# EAGLE design Sensor_Module_0x09_0x10_Pulse_v1 (EAGLE 9.1.1)
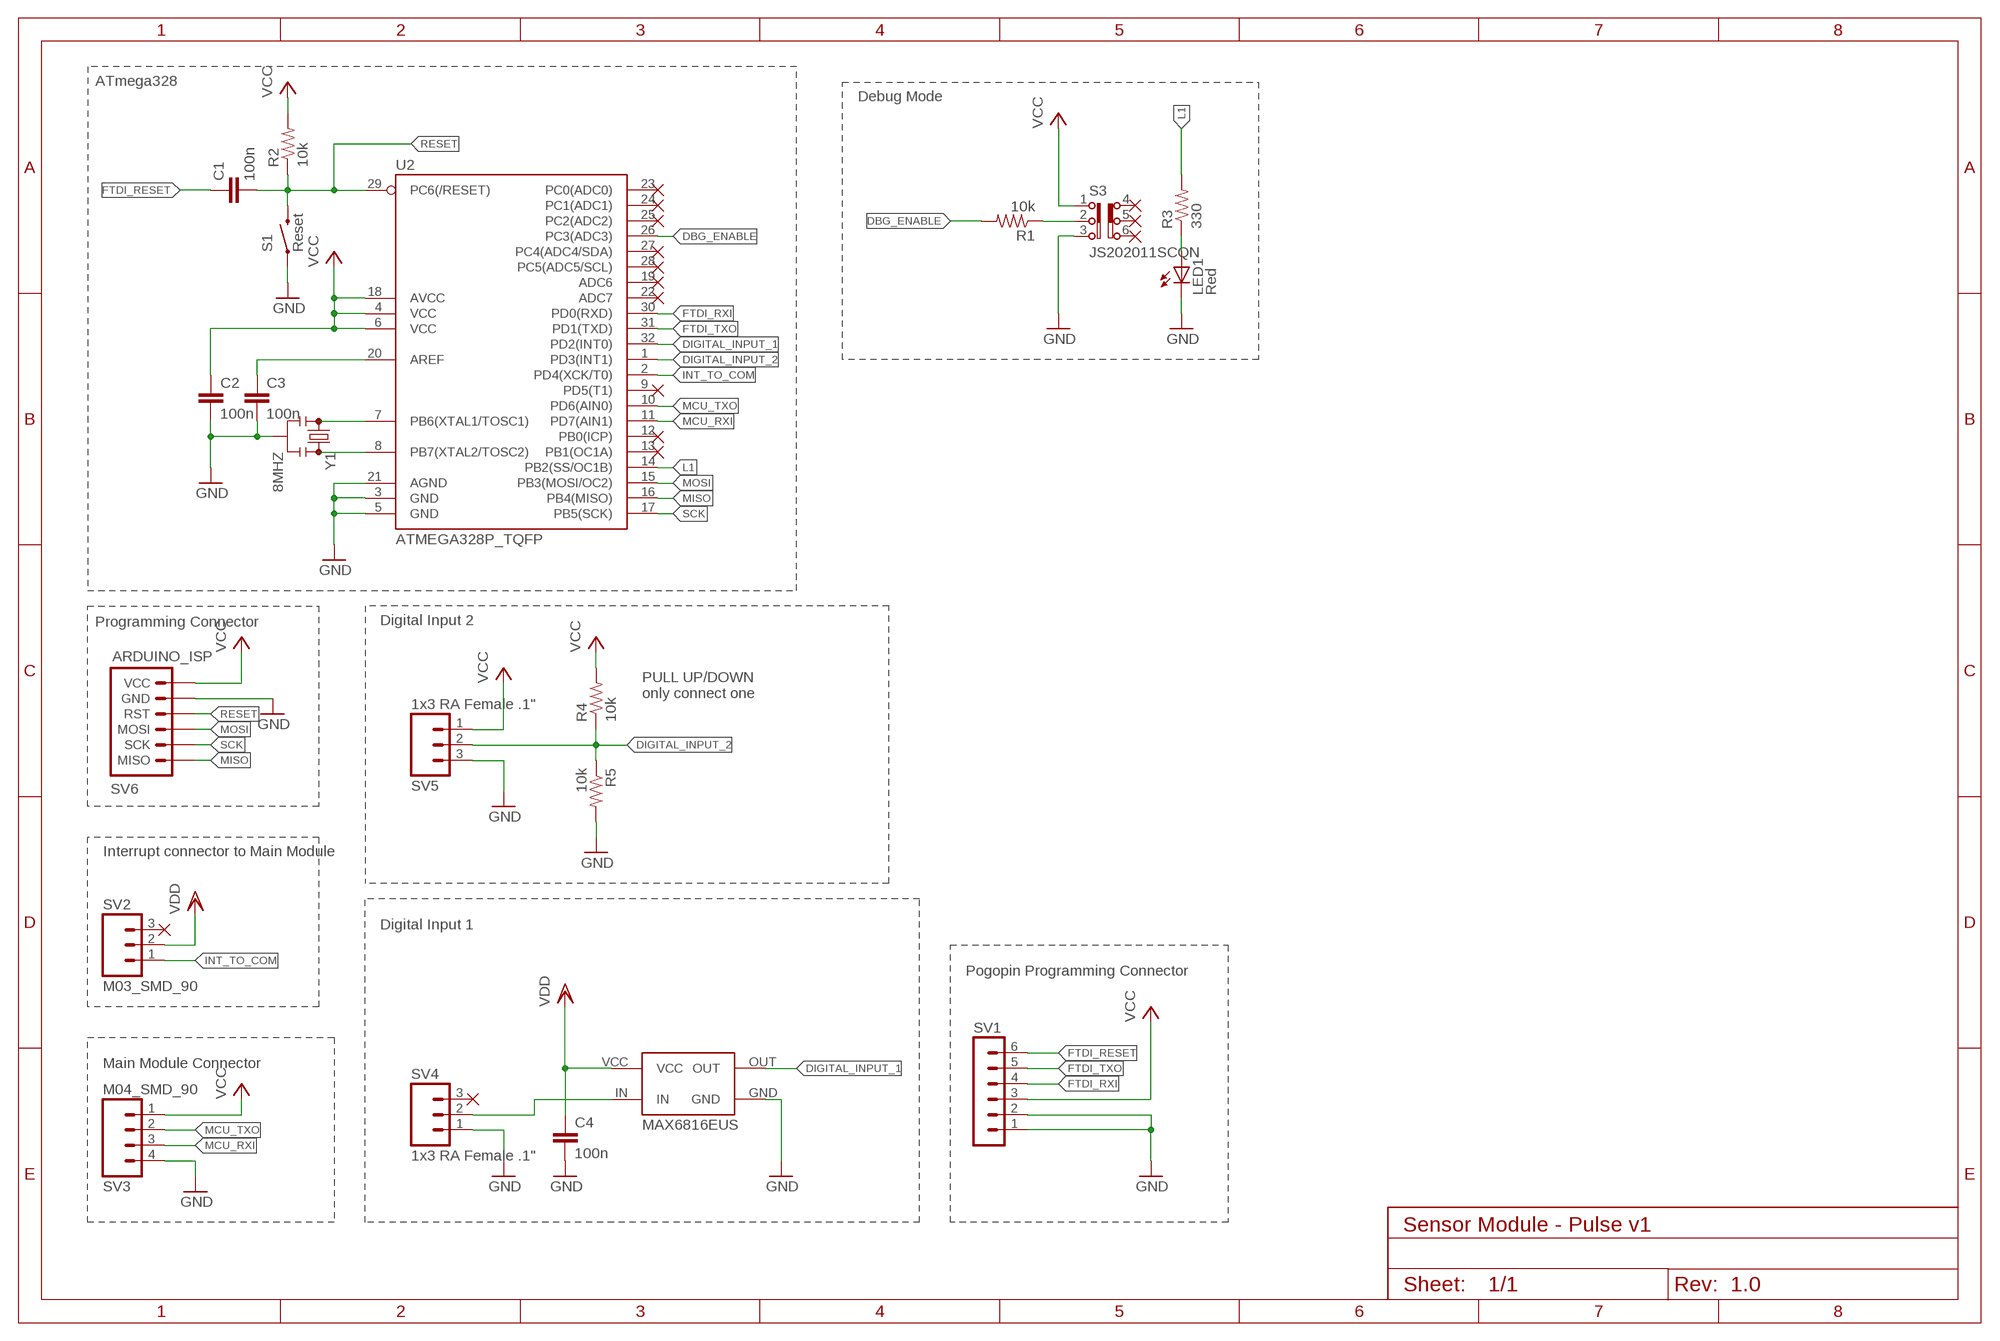
[diagram p0: schematic, sheet 1]
FRAME1 (FRAME-A4L): CNAME: Communication Module; CREVISION: 2.0

## Parts
C1  100n  C  [C0805]
C2  100n  C  [C0805]
C3  100n  C  [C0805]
C4  100n  C  [C0805]
LED1  Red  LEDSML0805  [SML0805]
R1  10k  RESISTOR0805-RES  [0805]
R2  10k  RESISTOR0805-RES  [0805]
R3  330  RESISTOR0805-RES  [0805]
R4  10k  RESISTOR0805-RES  [0805]
R5  10k  RESISTOR0805-RES  [0805]
S1  Reset  PUSHBUTTON  [M-PUSHBUTTON-SMD]
S3  JS202011SCQN  [JS202011SCQN]
SV1  MA06-1  [MA06-1]
SV2  M03_SMD_90  [M03_SMD_90]
SV3  M04_SMD_90  [M04_SMD_90]
SV4  1x3 RA Female .1"  M03SMD_RA_FEMALE  [1X03_SMD_RA_FEMALE]
SV5  1x3 RA Female .1"  M03SMD_RA_FEMALE  [1X03_SMD_RA_FEMALE]
SV6  ARDUINO_ISP  [M-2X3]
U2  ATMEGA328P_TQFP  [TQFP32-08]
U$2  MAX6816EUS  [SOT143]
Y1  8MHZ  RESONATOR8MHZ  [RESONATOR-SMD]

## Nets
DBG_ENABLE: R1.2 U2.26(PC3(ADC3))
DIGITAL_INPUT_1: U2.32(PD2(INT0)) U$2.OUT
DIGITAL_INPUT_2: R4.1 R5.1 SV5.2 U2.1(PD3(INT1))
FTDI_RESET: C1.1 SV1.6
FTDI_RXI: SV1.4 U2.30(PD0(RXD))
FTDI_TXO: SV1.5 U2.31(PD1(TXD))
GND [GND]: C2.2 C3.2 C4.2 LED1.C R5.2 S1.1(LEFT) S1.2(LEFT) S3.3 SV1.1 SV1.2 SV3.4 SV4.1 SV5.3 SV6.P$5(GND) U2.3(GND) U2.5(GND) U2.21(AGND) U$2.GND Y1.2
INT_TO_COM: SV2.1 U2.2(PD4(XCK/T0))
L1: R3.2 U2.14(PB2(SS/OC1B))
MCU_RXI: SV3.3 U2.11(PD7(AIN1))
MCU_TXO: SV3.2 U2.10(PD6(AIN0))
MISO: SV6.P$1(MISO) U2.16(PB4(MISO))
MOSI: SV6.P$3(MOSI) U2.15(PB3(MOSI/OC2))
N$1: U2.8(PB7(XTAL2/TOSC2)) Y1.3
N$2: U2.7(PB6(XTAL1/TOSC1)) Y1.1
N$3: R1.1 S3.2
N$4: SV4.2 U$2.IN
N$15: C3.1 U2.20(AREF)
N$30: LED1.A R3.1
RESET: C1.2 R2.1 S1.3(RIGHT) S1.4(RIGHT) SV6.P$4(RST) U2.29(PC6(/RESET))
SCK: SV6.P$2(SCK) U2.17(PB5(SCK))
VCC [Vsupply]: C2.1 R2.2 R4.2 S3.1 SV1.3 SV3.1 SV5.1 SV6.P$6(VCC) U2.4(VCC) U2.6(VCC) U2.18(AVCC)
VDD [Vsupply]: C4.1 SV2.2 U$2.VCC
Unconnected: S3.4 S3.5 S3.6 SV2.3 SV4.3 U2.9(PD5(T1)) U2.12(PB0(ICP)) U2.13(PB1(OC1A)) U2.19(ADC6) U2.22(ADC7) U2.23(PC0(ADC0)) U2.24(PC1(ADC1)) U2.25(PC2(ADC2)) U2.27(PC4(ADC4/SDA)) U2.28(PC5(ADC5/SCL))

## Notes on the sheet
- ATmega328
- Debug Mode
- Programming Connector | Digital Input 2
- PULL UP/DOWN
  only connect one
- Interrupt connector to Main Module
- Digital Input 1
- Pogopin Programming Connector
- Main Module Connector
- Sensor Module - Pulse v1
- 1.0

## Library data of the parts
C1-C4 = eagle-ltspice:C: CAPACITOR, European symbol; SPICEMODEL: NONE; SPICEPREFIX: C
LED1 = led:LED: LED OSRAM: - CHIPLED LG R971, LG N971, LY N971, LG Q971, LY Q971, LO R971, LY R971 LH N974, LH R974 LS Q976, LO Q976, LY Q976 LO Q996 - Hyper CHIPLED LW Q18S LB Q993, LB Q99A, LB R99A - SideLED LS A670, LO A670, LY A670, LG A670, LP A670 LB A673, LV A673, LT A673, LW A673 LH A674 LY A675 LS A676, LA A676, LO A676, LY A676, LW A676 LS A679, LY A679, LG A679 - Hyper Micro SIDELED® LS Y876, LA Y876, LO Y876, LY Y876 LT Y87S - SmartLED LW L88C, LW L88S LB L89C, LB L89S, LG L890 LS L89K, LO L89K, LY L89K LS L896, LA L896, LO L896, LY L896 - TOPLED LS T670, LO T670, LY T670, LG T670, LP T670 LSG T670, LSP T670, LSY T670, LOP T670, LYG T670 LG T671, LOG T671, LSG T671 LB T673, LV T673, LT T673, LW T673 LH T674 LS T676, LA T676, LO T676, LY T676, LB T676, LH T676, LSB T676, LW T676 LB T67C, LV T67C, LT T67C, LS T67K, LO T67K, LY T67K, LW E67C LS E67B, LA E67B, LO E67B, LY E67B, LB E67C, LV E67C, LT E67C LW T67C LS T679, LY T679, LG T679 LS T770, LO T770, LY T770, LG T770, LP T770 LB T773, LV T773, LT T773, LW T773 LH T774 LS E675, LA E675, LY E675, LS T675 LS T776, LA T776, LO T776, LY T776, LB T776 LHGB T686 LT T68C, LB T68C - Hyper Mini TOPLED® LB M676 - Mini TOPLED Santana® LG M470 LS M47K, LO M47K, LY M47K Source: http://www.osram.convergy.de LUXEON: - LUMILED® LXK2-PW12-R00, LXK2-PW12-S00, LXK2-PW14-U00, LXK2-PW14-V00 LXK2-PM12-R00, LXK2-PM12-S00, LXK2-PM14-U00 LXK2-PE12-Q00, LXK2-PE12-R00, LXK2-PE12-S00, LXK2-PE14-T00, LXK2-PE14-U00 LXK2-PB12-K00, LXK2-PB12-L00, LXK2-PB12-M00, LXK2-PB14-N00, LXK2-PB14-P00, LXK2-PB14-Q00 LXK2-PR12-L00, LXK2-PR12-M00, LXK2-PR14-Q00, LXK2-PR14-R00 LXK2-PD12-Q00, LXK2-PD12-R00, LXK2-PD12-S00 LXK2-PH12-R00, LXK2-PH12-S00 LXK2-PL12-P00, LXK2-PL12-Q00, LXK2-PL12-R00 Source: www.luxeon.com KINGBRIGHT: KA-3528ASYC Source: www.kingbright.com
R1-R5 = SparkFun-Passives:RESISTOR: Resistor Basic schematic elements and footprints for 0603, 1206, and PTH resistors.
S1 = marc_library:PUSHBUTTON
S3 = myownthings:JS202011SCQN: DPDT SLIDE SWITCH
SV1 = con-lstb:MA06-1: PIN HEADER; OC_FARNELL: unknown; OC_NEWARK: unknown
SV2 = myownthings:M03_SMD_90
SV3 = myownthings:M04_SMD_90
SV4 SV5 = SparkFun-Connectors:M03: Header 3 Standard 3-pin 0.1" header. Use with straight break away headers (SKU : PRT-00116), right angle break away headers (PRT-00553), swiss pins (PRT-00743), machine pins (PRT-00117), and female headers (PRT-00115). Molex polarized connector foot print use with SKU : PRT-08232 with associated crimp pins and housings.; PROD_ID: CONN-10926
SV6 = marc_library:ARDUINO_ISP: AVR ISP 6-pin inline header for Arduino ISP
U2 = marc_library:ATMEGA328P_TQFP; PROD_ID: IC-09069
U$2 = myownthings:MAX6816EUS
Y1 = marc_library:RESONATOR: Resonator Small SMD resonator. Used, eg, on the Arduino Pro/ Pro Mini boards. 8MHz- XTAL-08895 16MHz- XTAL-08900; PROD_ID: XTAL-08895

## Net classes
0 default: width 0.3 mm
1 Vsupply: width 0.5 mm
5 GND: width 0.5 mm

## Board
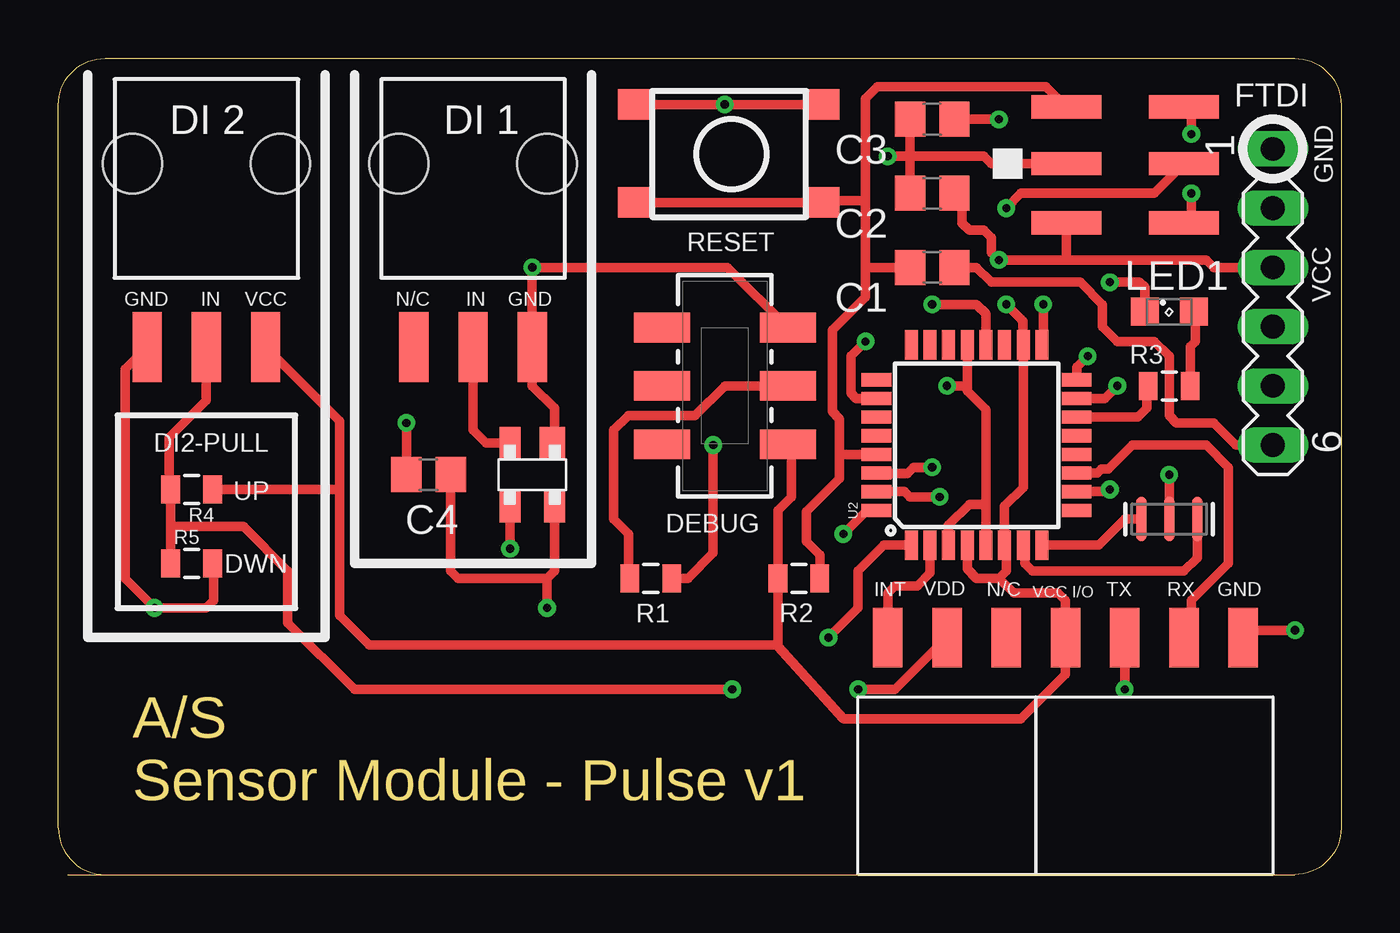
[diagram p1: board, top side]
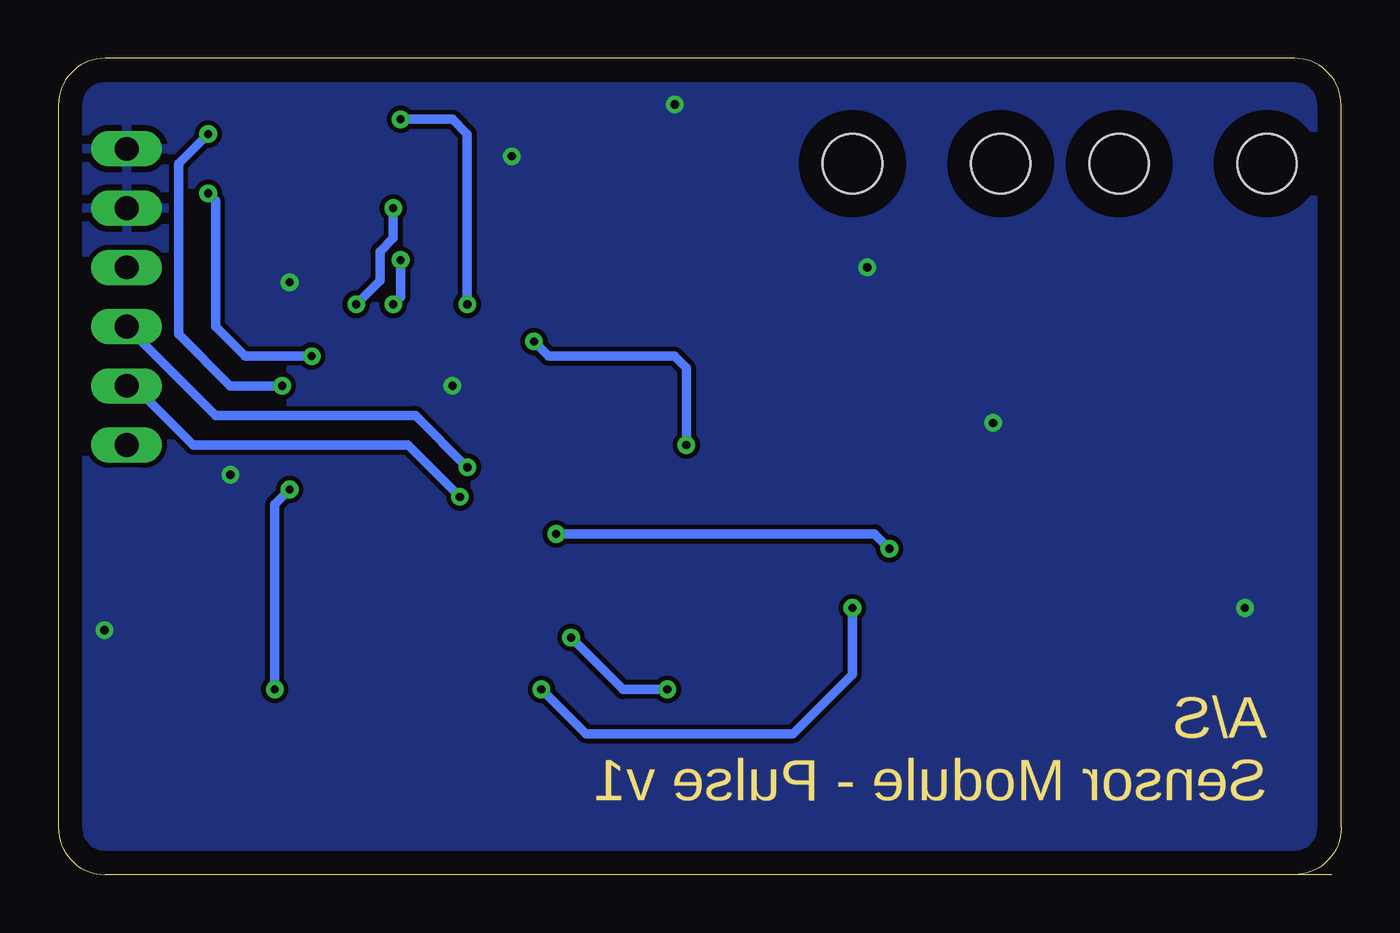
[diagram p2: board, bottom side, seen from below]

Size 55 x 35 mm. Coordinates in mm from the lower left corner, seen from the top.
Outline: 2,0 arc-90 0,2 0,33 arc-90 2,35 53,35 arc-90 55,33 55,2 arc-90 53,0 2,0
Outline: 0.41,0 2,0
Copper layers (1*16): Top 0.035mm / dielectric 1.5mm / Bottom 0.035mm
Design rules "default *": minimum track width 14mil, minimum drill 24mil, track to track 8mil, track to pad 8mil, pad to pad 8mil, via to via 12mil, smd to smd 8mil, copper to edge 40mil, drill to drill 20mil, minimum pad ring 10mil, minimum via ring 8mil, stop-mask expansion 4mil, vias tented up to drill 0mil, thermal gap 10mil
Holes 2.54 mm at 9.53,30.48 3.17,30.48 20.95,30.48 14.61,30.48

### Footprints (pad centres in the part's own frame; a part is rotated, then mirrored left to right if it is on the bottom)
C0805 = smd 1.3 x 1.5: 1 -0.95,0; 2 0.95,0
SML0805 = smd 1.2 x 1.2: A 1.05,0; C -1.05,0
0805 = smd 0.8 x 1.2: 1 -0.9,0; 2 0.9,0
M-PUSHBUTTON-SMD = smd 1.55 x 1.3: 1 0,0; 2 7.95,0; 3 0,-4.2; 4 7.95,-4.2
JS202011SCQN = smd 1.27 x 2.4: 1 -2.5,-2.7; 2 0,-2.7; 3 2.5,-2.7; 4 -2.5,2.7; 5 0,2.7; 6 2.5,2.7
MA06-1 = drill 1.016 long: 1 -6.35,0; 2 -3.81,0; 3 -1.27,0; 4 1.27,0; 5 3.81,0; 6 6.35,0
M03_SMD_90 = smd 1.27 x 2.54: 1 0,0; 2 2.54,0; 3 5.08,0
M04_SMD_90 = smd 1.27 x 2.54: 1 0,0; 2 2.54,0; 3 5.08,0; 4 7.62,0
1X03_SMD_RA_FEMALE = smd 1.25 x 3: 1 -2.54,7.225; 2 0,7.225; 3 2.54,7.225
M-2X3 = smd 1 x 3: P$1 0,0; P$2 2.54,0; P$3 4.98,0; P$4 4.98,5.05; P$5 2.54,5.05; P$6 0,5.05
TQFP32-08 = smd 1.27 x 0.559: 1 -4.293,2.8; 2 -4.293,2; 3 -4.293,1.2; 4 -4.293,0.4; 5 -4.293,-0.4; 6 -4.293,-1.2; 7 -4.293,-2; 8 -4.293,-2.8; 17 4.293,-2.8; 18 4.293,-2; 19 4.293,-1.2; 20 4.293,-0.4; 21 4.293,0.4; 22 4.293,1.2; 23 4.293,2; 24 4.293,2.8 | smd 0.559 x 1.27: 9 -2.8,-4.293; 10 -2,-4.293; 11 -1.2,-4.293; 12 -0.4,-4.293; 13 0.4,-4.293; 14 1.2,-4.293; 15 2,-4.293; 16 2.8,-4.293; 25 2.8,4.293; 26 2,4.293; 27 1.2,4.293; 28 0.4,4.293; 29 -0.4,4.293; 30 -1.2,4.293; 31 -2,4.293; 32 -2.8,4.293
SOT143 = smd 1.4 x 1.1: GND -1.35,0.86 | smd 1.4 x 0.9: IN -1.35,-0.96; OUT 1.35,-0.96; VCC 1.35,0.96
RESONATOR-SMD = smd 0.45 x 1.905: 1 -1.2,0; 2 0,0; 3 1.2,0

### Placement (x,y rotation side)
C1  37.47,26.04 180 top
C2  37.47,29.21 180 top
C3  37.47,32.38 180 top
C4  15.88,17.14 180 top
LED1  47.62,24.13 0 top
R1  25.4,12.7 0 top
R2  31.75,12.7 180 top
R3  47.62,20.95 180 top
R4  5.71,16.51 0 top
R5  5.71,13.34 0 top
S1  24.77,33.02 0 top
S3  28.57,20.95 90 top
SV1  52.07,24.77 270 top
SV2  35.56,10.16 0 top
SV3  43.18,10.16 0 top
SV4  17.78,29.84 180 top
SV5  6.35,29.84 180 top
SV6  48.26,27.94 90 top
U2  39.37,18.41 90 top
U$2  20.32,17.14 270 top
Y1  47.62,15.24 180 top

### Tracks (layer width: path | path; a pad name or v marks a point on that pad's centre or on a via)
DBG_ENABLE  (via drill 0.35)
  Top 0.406: U2.26 34.2,20.41 33.97,20.64 33.97,22.23 v34.61,22.86 | v28.08,18.41 28.08,13.79 26.99,12.7 R1.2
  Bottom 0.406: v34.61,22.86 33.97,22.23 28.57,22.23 28.08,21.73 v28.08,18.41
DIGITAL_INPUT_1  (via drill 0.35)
  Top 0.406: U2.32 34.66,15.62 v33.66,14.61 | v19.37,13.97 U$2.OUT
  Bottom 0.406: v19.37,13.97 20,14.61 v33.66,14.61
DIGITAL_INPUT_2  (via drill 0.35)
  Top 0.406: SV5.2 6.35,20.32 4.76,18.73 4.76,16.56 | 4.76,16.56 R4.1 | R5.1 4.82,14.92 | 4.82,14.92 R4.1 | R4.1 4.76,16.56 | 4.82,14.92 7.94,14.92 9.84,13.02 9.84,10.79 12.7,7.94 v28.89,7.94 | v33.02,10.16 34.29,11.43 34.29,13.02 35.4,14.12 U2.1
  Bottom 0.406: v28.89,7.94 30.8,7.94 v33.02,10.16
FTDI_RESET
  Top 0.406: C1.1 39.37,26.04 40.01,25.4 43.81,25.4 44.77,24.45 44.77,23.5 45.4,22.86 46.99,22.86 47.62,22.23 47.62,19.68 47.94,19.37 49.53,19.37 50.48,18.41 SV1.6
FTDI_RXI  (via drill 0.35)
  Top 0.406: v37.47,17.46 36.67,17.46 36.4,17.2 35.09,17.2 U2.30
  Bottom 0.406: SV1.4 48.26,19.68 39.69,19.68 v37.47,17.46
FTDI_TXO  (via drill 0.35)
  Top 0.406: v37.78,16.19 36.51,16.19 36.28,16.41 U2.31
  Bottom 0.406: SV1.5 51.75,20.95 49.21,18.41 40.01,18.41 v37.78,16.19
GND  (via drill 0.35)
  Top 0.406: S1.1 v28.57,33.02 S1.2 | Y1.2 v47.62,17.14 | SV3.4 51.12,10.48 v53.02,10.48 | LED1.C 46.58,25.18 46.35,25.4 v45.09,25.4 | 39.77,15.88 U2.5 | 39.77,15.88 39.77,19.93 38.98,20.73 38.98,20.95 | 38.98,20.95 U2.21 | U2.3 38.17,14.99 39.05,15.88 39.77,15.88 | v38.1,20.95 38.98,20.95 | S3.3 28.7,26.04 v20.32,26.04 SV4.1 20.32,20.95 21.27,20 21.27,18.59 U$2.GND | C4.2 v14.92,19.37 | SV5.3 2.86,21.67 2.86,12.7 v4.13,11.43 6.35,11.43 6.67,11.75 6.67,13.28 R5.2 | 36.52,30.8 C3.2 | 36.52,30.8 C2.2 | 36.52,30.8 39.69,30.8 40.01,30.48 SV6.P$5 | v35.56,30.8 36.52,30.8
  pour Bottom: 55,33 55,2 arc-90 53,0 2,0 arc-90 0,2 0,33 arc-90 2,35 53,35 arc-90
INT_TO_COM
  Top 0.406: U2.2 37.37,12.92 36.83,12.38 35.88,12.38 35.56,12.06 SV2.1
L1
  Top 0.406: U2.14 46.28,19.61 46.67,20 46.67,20.9 R3.2
MCU_RXI
  Top 0.406: SV3.3 48.58,10.48 48.58,11.75 50.16,13.34 50.16,17.46 49.21,18.41 46.04,18.41 45.02,17.4 44.72,17.4 44.54,17.21 U2.11
MCU_TXO  (via drill 0.35)
  Top 0.406: SV3.2 v45.72,7.94 | U2.10 44.99,16.41 v45.09,16.51
  Bottom 0.406: v45.72,7.94 45.72,15.88 v45.09,16.51
MISO  (via drill 0.35)
  Top 0.406: U2.16 43.66,21.75 v44.13,22.23 | v48.58,29.21 48.58,28.26 SV6.P$1
  Bottom 0.406: v44.13,22.23 46.99,22.23 48.26,23.5 48.26,28.89 v48.58,29.21
MOSI  (via drill 0.35)
  Top 0.406: U2.15 44.86,20.41 v45.4,20.95 | v48.58,31.75 48.58,32.6 SV6.P$3
  Bottom 0.406: v45.4,20.95 47.62,20.95 49.85,23.18 49.85,30.48 v48.58,31.75
N$1
  Top 0.406: U2.8 44.6,14.12 45.72,15.24 Y1.3
N$2
  Top 0.406: Y1.1 48.83,13.58 48.26,13.02 41.75,13.02 41.43,13.34 41.43,14.06 U2.7
N$3
  Top 0.406: S3.2 28.57,20.95 27.3,19.68 24.45,19.68 23.81,19.05 23.81,15.24 24.45,14.61 24.45,12.75 R1.1
N$4
  Top 0.406: SV4.2 17.78,19.05 18.34,18.5 U$2.IN
N$15  (via drill 0.35)
  Top 0.406: C3.1 v40.32,32.38 | v37.47,24.45 39.37,24.45 39.77,24.05 U2.20
  Bottom 0.406: v40.32,32.38 38.1,32.38 37.47,31.75 v37.47,24.45
N$30
  Top 0.406: R3.1 48.52,22.65 48.74,22.86 48.74,24.07 LED1.A
RESET
  Top 0.406: SV6.P$4 42.35,33.78 35.12,33.78 34.61,33.27 34.61,28.89 | 34.61,28.89 34.61,26.04 | 24.84,28.89 S1.3 S1.4 32.79,28.89 34.61,28.89 | 34.61,26.04 34.61,24.77 33.18,23.34 33.18,19.84 33.5,19.53 33.5,17.94 | U2.29 33.57,18.02 33.5,17.94 | C1.2 34.61,26.04 | R2.1 32.65,13.71 32.07,14.29 32.07,15.56 33.5,16.99 33.5,17.94
SCK  (via drill 0.35)
  Top 0.406: SV6.P$2 46.99,29.21 41.27,29.21 v40.64,28.57 | v42.23,24.45 42.23,22.77 U2.17
  Bottom 0.406: v40.64,28.57 40.64,27.29 41.21,26.72 41.21,25.47 v42.23,24.45
VCC  (via drill 0.35)
  Top 0.406: SV1.3 49.53,26.04 49.21,26.35 43.18,26.35 | C2.1 38.73,28.89 38.73,27.94 39.05,27.62 39.69,27.62 40.01,27.3 40.01,26.67 v40.32,26.35 43.18,26.35 | SV6.P$6 43.21,26.38 43.18,26.35 | v40.64,24.45 41.27,23.81 41.28,23.81 41.35,23.73 41.35,22.72 U2.18 41.37,16.61 40.57,15.8 U2.6 40.64,14.05 40.64,13.02 40.32,12.7 | S3.1 31.43,18.3 31.43,16.19 30.85,15.61 R2.2 30.85,9.84 | U2.4 38.97,13.1 39.37,12.7 40.32,12.7 | 40.32,12.7 40.96,12.06 42.86,12.06 43.18,11.75 SV3.1 43.18,8.57 41.27,6.67 33.66,6.67 30.85,9.79 30.85,9.84 | SV5.1 12.06,19.45 12.06,16.51 | 12.06,16.51 12.06,11.11 13.34,9.84 30.85,9.84 | R4.2 12.06,16.51
  Bottom 0.406: v40.32,26.35 40.32,24.77 v40.64,24.45
VDD  (via drill 0.35)
  Top 0.406: C4.1 16.83,13.02 17.14,12.7 20.95,12.7 | 20.95,12.7 21.27,13.02 21.27,14.61 21.28,14.61 U$2.VCC | SV2.2 35.88,7.94 v34.29,7.94 | v20.95,11.43 20.95,12.7
  Bottom 0.406: v34.29,7.94 32.38,6.03 23.5,6.03 20.95,8.57 v20.95,11.43

### Text on the board
Dimension: A/S / Sensor Module - Pulse v1
tPlace: FTDI | DI 2 | DI 1 | GND | RESET | VCC | GND | IN | VCC | N/C | IN | GND | DI2-PULL | UP | DEBUG | DWN | INT | VDD | N/C | TX | RX | GND | VCC I/O